# Altium project reflexios_front.PrjPcb
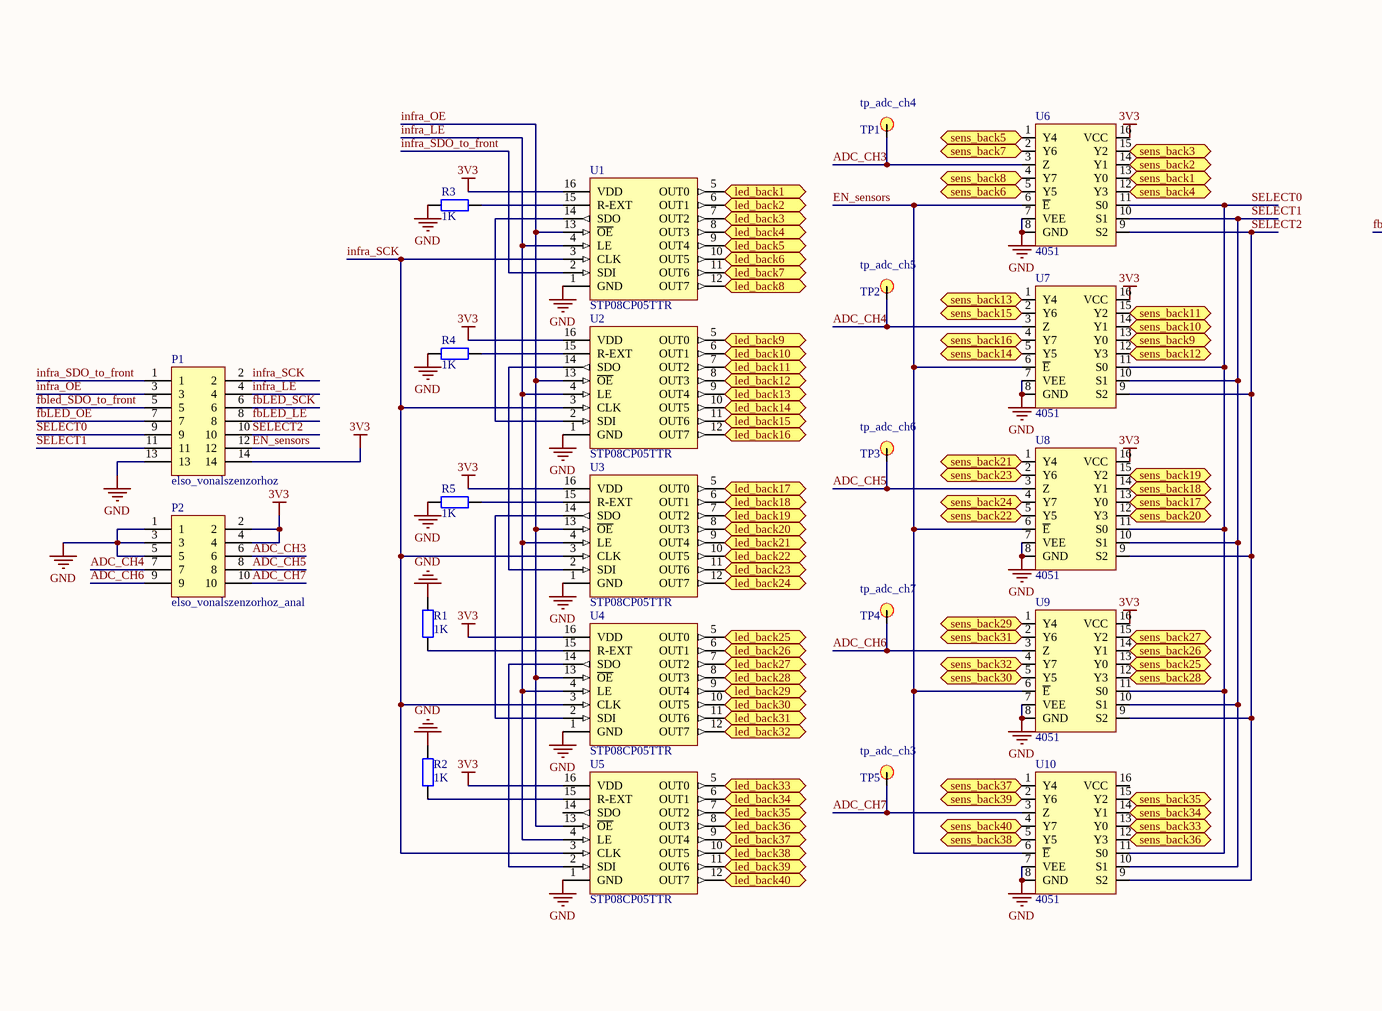
[diagram p0: front.SchDoc, top left]
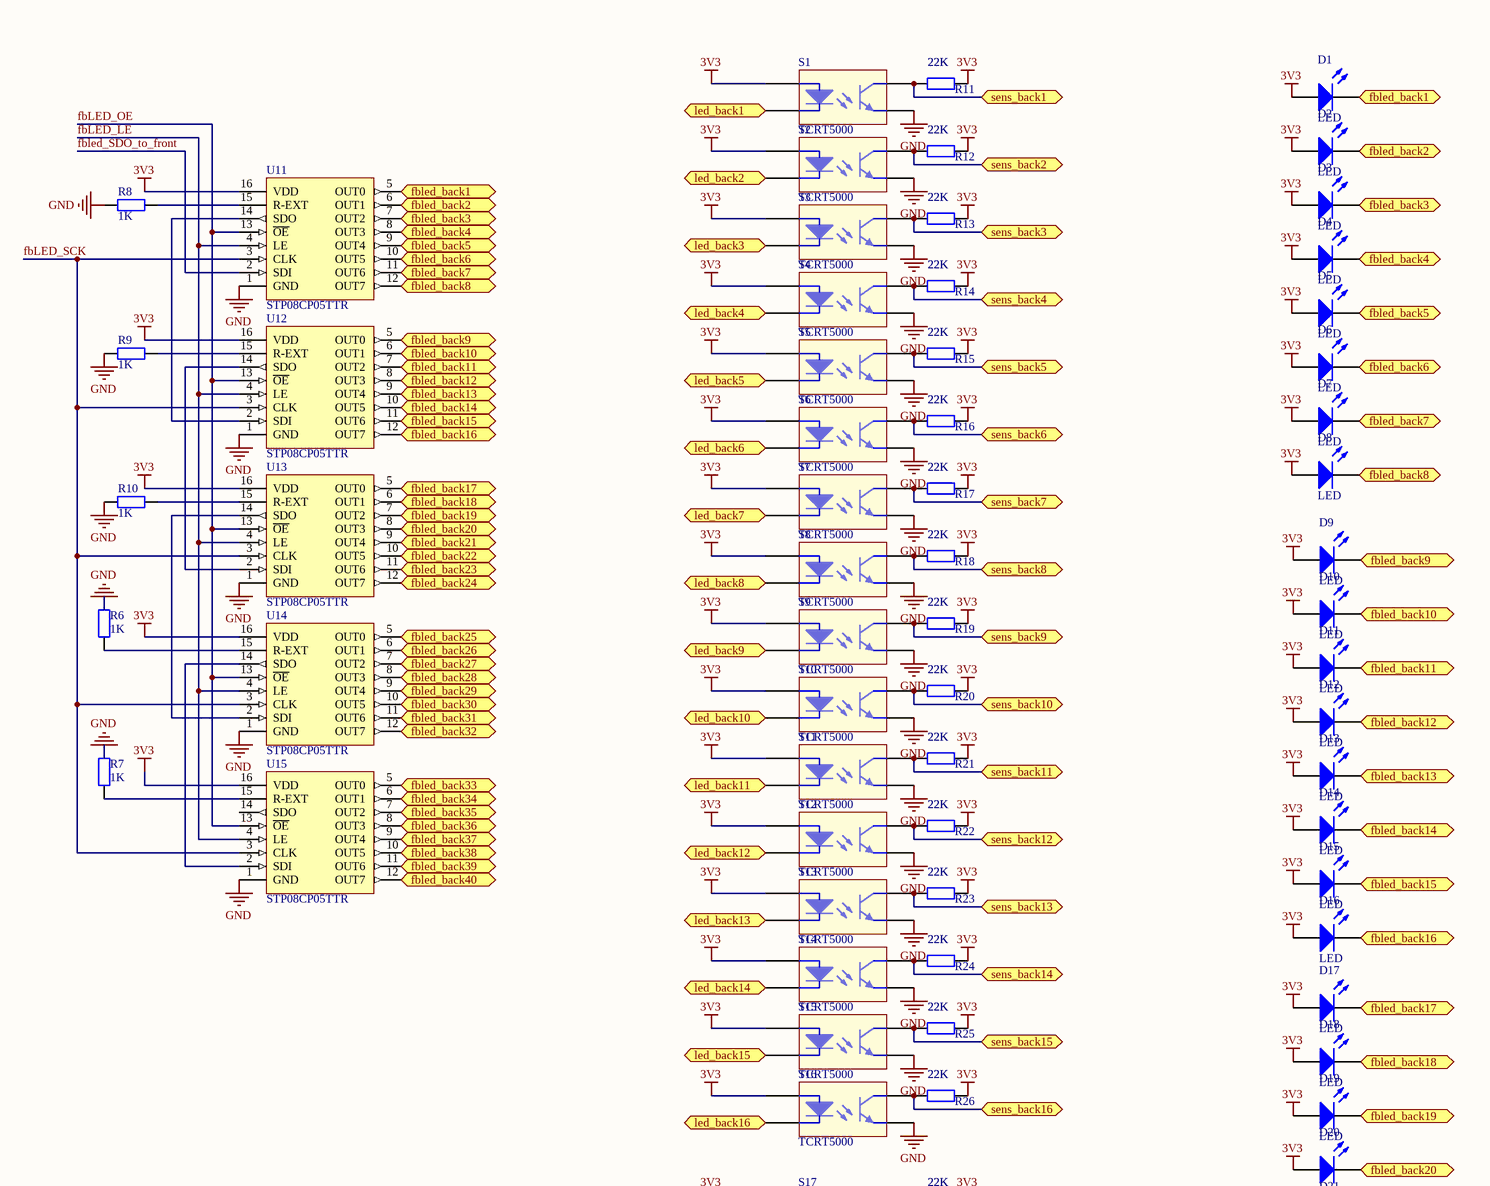
[diagram p1: front.SchDoc, top right]
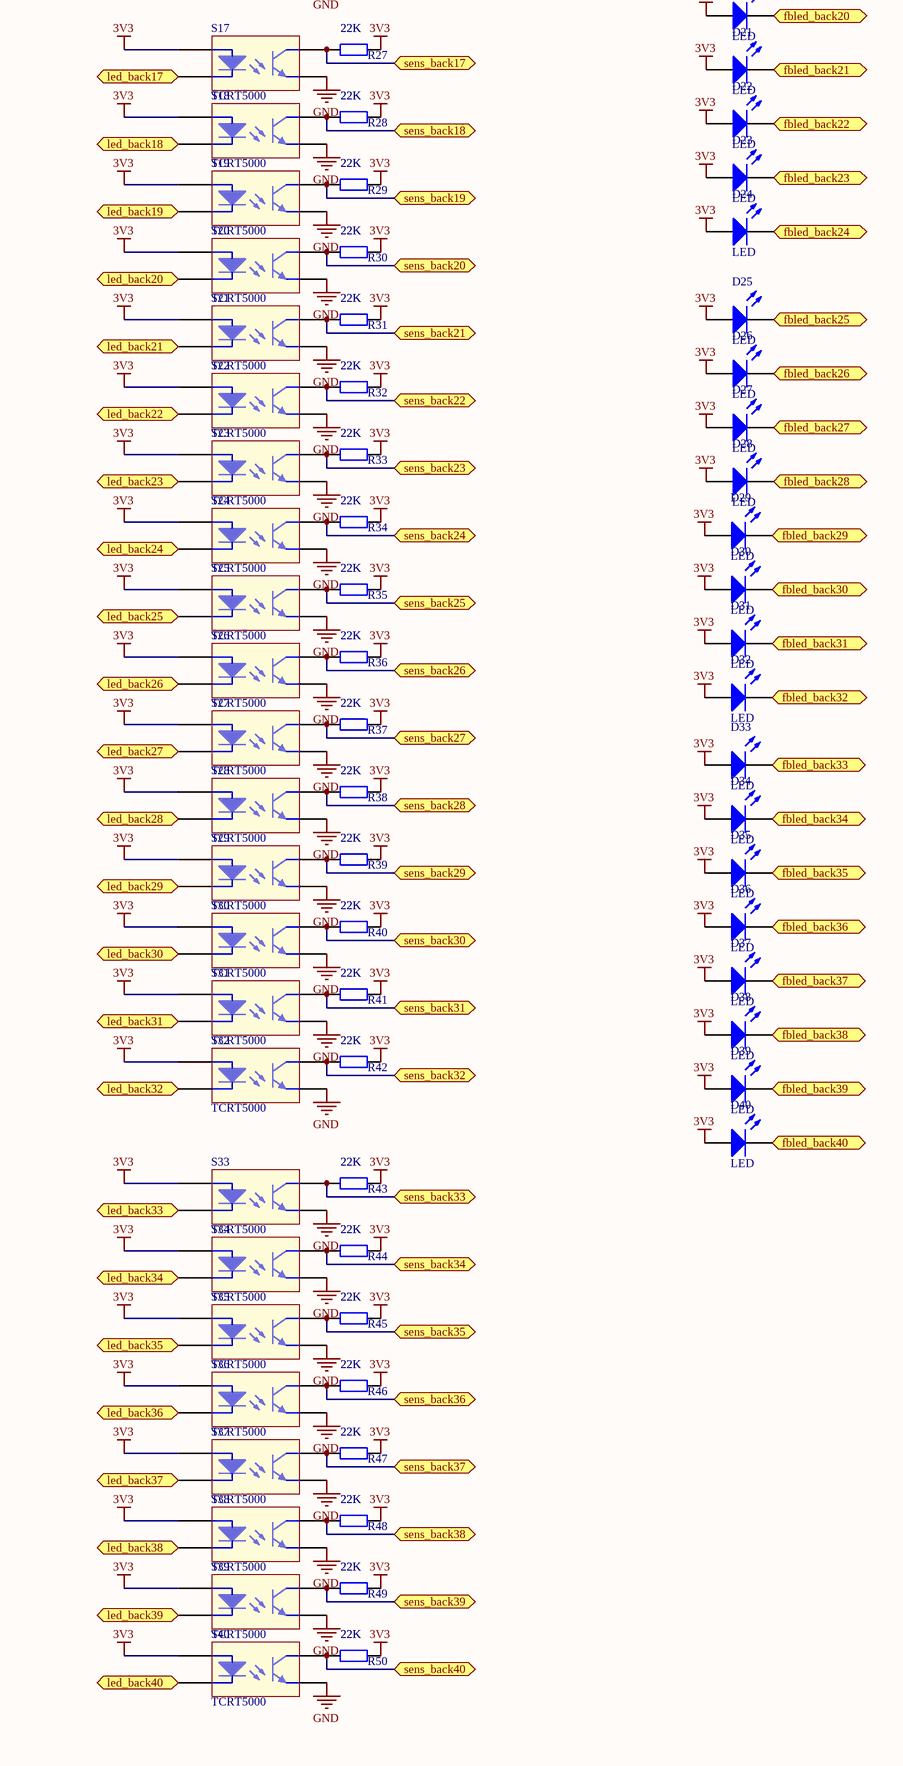
[diagram p2: front.SchDoc, bottom right]
1 sheet, 152 parts. Net scope: flat (ports and power ports of the same name join across sheets).
Board file: 6C-2L-1550um.PcbDoc

## Sheet front.SchDoc
size A0

### Parts
D1  LED  [FP_1210_LED]
D2  LED  [FP_1210_LED]
D3  LED  [FP_1210_LED]
D4  LED  [FP_1210_LED]
D5  LED  [FP_1210_LED]
D6  LED  [FP_1210_LED]
D7  LED  [FP_1210_LED]
D8  LED  [FP_1210_LED]
D9  LED  [FP_1210_LED]
D10  LED  [FP_1210_LED]
D11  LED  [FP_1210_LED]
D12  LED  [FP_1210_LED]
D13  LED  [FP_1210_LED]
D14  LED  [FP_1210_LED]
D15  LED  [FP_1210_LED]
D16  LED  [FP_1210_LED]
D17  LED  [FP_1210_LED]
D18  LED  [FP_1210_LED]
D19  LED  [FP_1210_LED]
D20  LED  [FP_1210_LED]
D21  LED  [FP_1210_LED]
D22  LED  [FP_1210_LED]
D23  LED  [FP_1210_LED]
D24  LED  [FP_1210_LED]
D25  LED  [FP_1210_LED]
D26  LED  [FP_1210_LED]
D27  LED  [FP_1210_LED]
D28  LED  [FP_1210_LED]
D29  LED  [FP_1210_LED]
D30  LED  [FP_1210_LED]
D31  LED  [FP_1210_LED]
D32  LED  [FP_1210_LED]
D33  LED  [FP_1210_LED]
D34  LED  [FP_1210_LED]
D35  LED  [FP_1210_LED]
D36  LED  [FP_1210_LED]
D37  LED  [FP_1210_LED]
D38  LED  [FP_1210_LED]
D39  LED  [FP_1210_LED]
D40  LED  [FP_1210_LED]
P1  elso_vonalszenzorhoz  [FP_CONN14]
P2  elso_vonalszenzorhoz_anal  [FP_CONN10]
R1  1K  [FP_1206_RES]
R2  1K  [FP_1206_RES]
R3  1K  [FP_1206_RES]
R4  1K  [FP_1206_RES]
R5  1K  [FP_1206_RES]
R6  1K  [FP_1206_RES]
R7  1K  [FP_1206_RES]
R8  1K  [FP_1206_RES]
R9  1K  [FP_1206_RES]
R10  1K  [FP_1206_RES]
R11  22K  [FP_1206_RES]
R12  22K  [FP_1206_RES]
R13  22K  [FP_1206_RES]
R14  22K  [FP_1206_RES]
R15  22K  [FP_1206_RES]
R16  22K  [FP_1206_RES]
R17  22K  [FP_1206_RES]
R18  22K  [FP_1206_RES]
R19  22K  [FP_1206_RES]
R20  22K  [FP_1206_RES]
R21  22K  [FP_1206_RES]
R22  22K  [FP_1206_RES]
R23  22K  [FP_1206_RES]
R24  22K  [FP_1206_RES]
R25  22K  [FP_1206_RES]
R26  22K  [FP_1206_RES]
R27  22K  [FP_1206_RES]
R28  22K  [FP_1206_RES]
R29  22K  [FP_1206_RES]
R30  22K  [FP_1206_RES]
R31  22K  [FP_1206_RES]
R32  22K  [FP_1206_RES]
R33  22K  [FP_1206_RES]
R34  22K  [FP_1206_RES]
R35  22K  [FP_1206_RES]
R36  22K  [FP_1206_RES]
R37  22K  [FP_1206_RES]
R38  22K  [FP_1206_RES]
R39  22K  [FP_1206_RES]
R40  22K  [FP_1206_RES]
R41  22K  [FP_1206_RES]
R42  22K  [FP_1206_RES]
R43  22K  [FP_1206_RES]
R44  22K  [FP_1206_RES]
R45  22K  [FP_1206_RES]
R46  22K  [FP_1206_RES]
R47  22K  [FP_1206_RES]
R48  22K  [FP_1206_RES]
R49  22K  [FP_1206_RES]
R50  22K  [FP_1206_RES]
S1  TCRT5000  [TCRT5000]
S2  TCRT5000  [TCRT5000]
S3  TCRT5000  [TCRT5000]
S4  TCRT5000  [TCRT5000]
S5  TCRT5000  [TCRT5000]
S6  TCRT5000  [TCRT5000]
S7  TCRT5000  [TCRT5000]
S8  TCRT5000  [TCRT5000]
S9  TCRT5000  [TCRT5000]
S10  TCRT5000  [TCRT5000]
S11  TCRT5000  [TCRT5000]
S12  TCRT5000  [TCRT5000]
S13  TCRT5000  [TCRT5000]
S14  TCRT5000  [TCRT5000]
S15  TCRT5000  [TCRT5000]
S16  TCRT5000  [TCRT5000]
S17  TCRT5000  [TCRT5000]
S18  TCRT5000  [TCRT5000]
S19  TCRT5000  [TCRT5000]
S20  TCRT5000  [TCRT5000]
S21  TCRT5000  [TCRT5000]
S22  TCRT5000  [TCRT5000]
S23  TCRT5000  [TCRT5000]
S24  TCRT5000  [TCRT5000]
S25  TCRT5000  [TCRT5000]
S26  TCRT5000  [TCRT5000]
S27  TCRT5000  [TCRT5000]
S28  TCRT5000  [TCRT5000]
S29  TCRT5000  [TCRT5000]
S30  TCRT5000  [TCRT5000]
S31  TCRT5000  [TCRT5000]
S32  TCRT5000  [TCRT5000]
S33  TCRT5000  [TCRT5000]
S34  TCRT5000  [TCRT5000]
S35  TCRT5000  [TCRT5000]
S36  TCRT5000  [TCRT5000]
S37  TCRT5000  [TCRT5000]
S38  TCRT5000  [TCRT5000]
S39  TCRT5000  [TCRT5000]
S40  TCRT5000  [TCRT5000]
TP1  tp_adc_ch4
TP2  tp_adc_ch5
TP3  tp_adc_ch6
TP4  tp_adc_ch7
TP5  tp_adc_ch3
U1  STP08CP05TTR  [TSOP65P640X120-16M]
U2  STP08CP05TTR  [TSOP65P640X120-16M]
U3  STP08CP05TTR  [TSOP65P640X120-16M]
U4  STP08CP05TTR  [TSOP65P640X120-16M]
U5  STP08CP05TTR  [TSOP65P640X120-16M]
U6  4051  [SO16_N]
U7  4051  [SO16_N]
U8  4051  [SO16_N]
U9  4051  [SO16_N]
U10  4051  [SO16_N]
U11  STP08CP05TTR  [TSOP65P640X120-16M]
U12  STP08CP05TTR  [TSOP65P640X120-16M]
U13  STP08CP05TTR  [TSOP65P640X120-16M]
U14  STP08CP05TTR  [TSOP65P640X120-16M]
U15  STP08CP05TTR  [TSOP65P640X120-16M]

### Ports
fbled_back1, fbled_back2, fbled_back3, fbled_back4, fbled_back5, fbled_back6, fbled_back7, fbled_back8, fbled_back9, fbled_back10, fbled_back11, fbled_back12, fbled_back13, fbled_back14, fbled_back15, fbled_back16, fbled_back17, fbled_back18, fbled_back19, fbled_back20, fbled_back21, fbled_back22, fbled_back23, fbled_back24, fbled_back25, fbled_back26, fbled_back27, fbled_back28, fbled_back29, fbled_back30, fbled_back31, fbled_back32, fbled_back33, fbled_back34, fbled_back35, fbled_back36, fbled_back37, fbled_back38, fbled_back39, fbled_back40, led_back1, led_back2, led_back3, led_back4, led_back5, led_back6, led_back7, led_back8, led_back9, led_back10, led_back11, led_back12, led_back13, led_back14, led_back15, led_back16, led_back17, led_back18, led_back19, led_back20, led_back21, led_back22, led_back23, led_back24, led_back25, led_back26, led_back27, led_back28, led_back29, led_back30, led_back31, led_back32, led_back33, led_back34, led_back35, led_back36, led_back37, led_back38, led_back39, led_back40, sens_back1, sens_back2, sens_back3, sens_back4, sens_back5, sens_back6, sens_back7, sens_back8, sens_back9, sens_back10, sens_back11, sens_back12, sens_back13, sens_back14, sens_back15, sens_back16, sens_back17, sens_back18, sens_back19, sens_back20, sens_back21, sens_back22, sens_back23, sens_back24, sens_back25, sens_back26, sens_back27, sens_back28, sens_back29, sens_back30, sens_back31, sens_back32, sens_back33, sens_back34, sens_back35, sens_back36, sens_back37, sens_back38, sens_back39, sens_back40

### Nets
3V3: D1.1(A) D2.1(A) D3.1(A) D4.1(A) D5.1(A) D6.1(A) D7.1(A) D8.1(A) D9.1(A) D10.1(A) D11.1(A) D12.1(A) D13.1(A) D14.1(A) D15.1(A) D16.1(A) D17.1(A) D18.1(A) D19.1(A) D20.1(A) D21.1(A) D22.1(A) D23.1(A) D24.1(A) D25.1(A) D26.1(A) D27.1(A) D28.1(A) D29.1(A) D30.1(A) D31.1(A) D32.1(A) D33.1(A) D34.1(A) D35.1(A) D36.1(A) D37.1(A) D38.1(A) D39.1(A) D40.1(A) P1.14 P2.2 P2.4 R11.2 R12.2 R13.2 R14.2 R15.2 R16.2 R17.2 R18.2 R19.2 R20.2 R21.2 R22.2 R23.2 R24.2 R25.2 R26.2 R27.2 R28.2 R29.2 R30.2 R31.2 R32.2 R33.2 R34.2 R35.2 R36.2 R37.2 R38.2 R39.2 R40.2 R41.2 R42.2 R43.2 R44.2 R45.2 R46.2 R47.2 R48.2 R49.2 R50.2 S1.1(A) S2.1(A) S3.1(A) S4.1(A) S5.1(A) S6.1(A) S7.1(A) S8.1(A) S9.1(A) S10.1(A) S11.1(A) S12.1(A) S13.1(A) S14.1(A) S15.1(A) S16.1(A) S17.1(A) S18.1(A) S19.1(A) S20.1(A) S21.1(A) S22.1(A) S23.1(A) S24.1(A) S25.1(A) S26.1(A) S27.1(A) S28.1(A) S29.1(A) S30.1(A) S31.1(A) S32.1(A) S33.1(A) S34.1(A) S35.1(A) S36.1(A) S37.1(A) S38.1(A) S39.1(A) S40.1(A) U1.16(VDD) U2.16(VDD) U3.16(VDD) U4.16(VDD) U5.16(VDD) U6.16(VCC) U7.16(VCC) U8.16(VCC) U9.16(VCC) U11.16(VDD) U12.16(VDD) U13.16(VDD) U14.16(VDD) U15.16(VDD)
GND: P1.13 P2.1 P2.3 P2.5 R1.1 R2.1 R3.1 R4.1 R5.1 R6.1 R7.1 R8.1 R9.1 R10.1 S1.4(E) S2.4(E) S3.4(E) S4.4(E) S5.4(E) S6.4(E) S7.4(E) S8.4(E) S9.4(E) S10.4(E) S11.4(E) S12.4(E) S13.4(E) S14.4(E) S15.4(E) S16.4(E) S17.4(E) S18.4(E) S19.4(E) S20.4(E) S21.4(E) S22.4(E) S23.4(E) S24.4(E) S25.4(E) S26.4(E) S27.4(E) S28.4(E) S29.4(E) S30.4(E) S31.4(E) S32.4(E) S33.4(E) S34.4(E) S35.4(E) S36.4(E) S37.4(E) S38.4(E) S39.4(E) S40.4(E) U1.1(GND) U2.1(GND) U3.1(GND) U4.1(GND) U5.1(GND) U6.7(VEE) U6.8(GND) U7.7(VEE) U7.8(GND) U8.7(VEE) U8.8(GND) U9.7(VEE) U9.8(GND) U10.7(VEE) U10.8(GND) U11.1(GND) U12.1(GND) U13.1(GND) U14.1(GND) U15.1(GND)
ADC_CH3: P2.6 TP1.1 U6.3(Z)
ADC_CH4: P2.7 TP2.1 U7.3(Z)
ADC_CH5: P2.8 TP3.1 U8.3(Z)
ADC_CH6: P2.9 TP4.1 U9.3(Z)
ADC_CH7: P2.10 TP5.1 U10.3(Z)
EN_sensors: P1.12 U6.6(~{E}) U7.6(~{E}) U8.6(~{E}) U9.6(~{E}) U10.6(~{E})
fbLED_LE: P1.8 U11.4(LE) U12.4(LE) U13.4(LE) U14.4(LE) U15.4(LE)
fbLED_OE: P1.7 U11.13(~{OE}) U12.13(~{OE}) U13.13(~{OE}) U14.13(~{OE}) U15.13(~{OE})
fbLED_SCK: P1.6 U11.3(CLK) U12.3(CLK) U13.3(CLK) U14.3(CLK) U15.3(CLK)
fbled_SDO_to_front: P1.5 U11.2(SDI)
infra_LE: P1.4 U1.4(LE) U2.4(LE) U3.4(LE) U4.4(LE) U5.4(LE)
infra_OE: P1.3 U1.13(~{OE}) U2.13(~{OE}) U3.13(~{OE}) U4.13(~{OE}) U5.13(~{OE})
infra_SCK: P1.2 U1.3(CLK) U2.3(CLK) U3.3(CLK) U4.3(CLK) U5.3(CLK)
infra_SDO_to_front: P1.1 U1.2(SDI)
SELECT0: P1.9 U6.11(S0) U7.11(S0) U8.11(S0) U9.11(S0) U10.11(S0)
SELECT1: P1.11 U6.10(S1) U7.10(S1) U8.10(S1) U9.10(S1) U10.10(S1)
SELECT2: P1.10 U6.9(S2) U7.9(S2) U8.9(S2) U9.9(S2) U10.9(S2)
NetD1_2: D1.2(K) U11.5(OUT0) ; port fbled_back1
NetD2_2: D2.2(K) U11.6(OUT1) ; port fbled_back2
NetD3_2: D3.2(K) U11.7(OUT2) ; port fbled_back3
NetD4_2: D4.2(K) U11.8(OUT3) ; port fbled_back4
NetD5_2: D5.2(K) U11.9(OUT4) ; port fbled_back5
NetD6_2: D6.2(K) U11.10(OUT5) ; port fbled_back6
NetD7_2: D7.2(K) U11.11(OUT6) ; port fbled_back7
NetD8_2: D8.2(K) U11.12(OUT7) ; port fbled_back8
NetD9_2: D9.2(K) U12.5(OUT0) ; port fbled_back9
NetD10_2: D10.2(K) U12.6(OUT1) ; port fbled_back10
NetD11_2: D11.2(K) U12.7(OUT2) ; port fbled_back11
NetD12_2: D12.2(K) U12.8(OUT3) ; port fbled_back12
NetD13_2: D13.2(K) U12.9(OUT4) ; port fbled_back13
NetD14_2: D14.2(K) U12.10(OUT5) ; port fbled_back14
NetD15_2: D15.2(K) U12.11(OUT6) ; port fbled_back15
NetD16_2: D16.2(K) U12.12(OUT7) ; port fbled_back16
NetD17_2: D17.2(K) U13.5(OUT0) ; port fbled_back17
NetD18_2: D18.2(K) U13.6(OUT1) ; port fbled_back18
NetD19_2: D19.2(K) U13.7(OUT2) ; port fbled_back19
NetD20_2: D20.2(K) U13.8(OUT3) ; port fbled_back20
NetD21_2: D21.2(K) U13.9(OUT4) ; port fbled_back21
NetD22_2: D22.2(K) U13.10(OUT5) ; port fbled_back22
NetD23_2: D23.2(K) U13.11(OUT6) ; port fbled_back23
NetD24_2: D24.2(K) U13.12(OUT7) ; port fbled_back24
NetD25_2: D25.2(K) U14.5(OUT0) ; port fbled_back25
NetD26_2: D26.2(K) U14.6(OUT1) ; port fbled_back26
NetD27_2: D27.2(K) U14.7(OUT2) ; port fbled_back27
NetD28_2: D28.2(K) U14.8(OUT3) ; port fbled_back28
NetD29_2: D29.2(K) U14.9(OUT4) ; port fbled_back29
NetD30_2: D30.2(K) U14.10(OUT5) ; port fbled_back30
NetD31_2: D31.2(K) U14.11(OUT6) ; port fbled_back31
NetD32_2: D32.2(K) U14.12(OUT7) ; port fbled_back32
NetD33_2: D33.2(K) U15.5(OUT0) ; port fbled_back33
NetD34_2: D34.2(K) U15.6(OUT1) ; port fbled_back34
NetD35_2: D35.2(K) U15.7(OUT2) ; port fbled_back35
NetD36_2: D36.2(K) U15.8(OUT3) ; port fbled_back36
NetD37_2: D37.2(K) U15.9(OUT4) ; port fbled_back37
NetD38_2: D38.2(K) U15.10(OUT5) ; port fbled_back38
NetD39_2: D39.2(K) U15.11(OUT6) ; port fbled_back39
NetD40_2: D40.2(K) U15.12(OUT7) ; port fbled_back40
NetR1_2: R1.2 U4.15(R-EXT)
NetR2_2: R2.2 U5.15(R-EXT)
NetR3_2: R3.2 U1.15(R-EXT)
NetR4_2: R4.2 U2.15(R-EXT)
NetR5_2: R5.2 U3.15(R-EXT)
NetR6_2: R6.2 U14.15(R-EXT)
NetR7_2: R7.2 U15.15(R-EXT)
NetR8_2: R8.2 U11.15(R-EXT)
NetR9_2: R9.2 U12.15(R-EXT)
NetR10_2: R10.2 U13.15(R-EXT)
NetR11_1: R11.1 S1.3(C) U6.13(Y0) ; port sens_back1
NetR12_1: R12.1 S2.3(C) U6.14(Y1) ; port sens_back2
NetR13_1: R13.1 S3.3(C) U6.15(Y2) ; port sens_back3
NetR14_1: R14.1 S4.3(C) U6.12(Y3) ; port sens_back4
NetR15_1: R15.1 S5.3(C) U6.1(Y4) ; port sens_back5
NetR16_1: R16.1 S6.3(C) U6.5(Y5) ; port sens_back6
NetR17_1: R17.1 S7.3(C) U6.2(Y6) ; port sens_back7
NetR18_1: R18.1 S8.3(C) U6.4(Y7) ; port sens_back8
NetR19_1: R19.1 S9.3(C) U7.13(Y0) ; port sens_back9
NetR20_1: R20.1 S10.3(C) U7.14(Y1) ; port sens_back10
NetR21_1: R21.1 S11.3(C) U7.15(Y2) ; port sens_back11
NetR22_1: R22.1 S12.3(C) U7.12(Y3) ; port sens_back12
NetR23_1: R23.1 S13.3(C) U7.1(Y4) ; port sens_back13
NetR24_1: R24.1 S14.3(C) U7.5(Y5) ; port sens_back14
NetR25_1: R25.1 S15.3(C) U7.2(Y6) ; port sens_back15
NetR26_1: R26.1 S16.3(C) U7.4(Y7) ; port sens_back16
NetR27_1: R27.1 S17.3(C) U8.13(Y0) ; port sens_back17
NetR28_1: R28.1 S18.3(C) U8.14(Y1) ; port sens_back18
NetR29_1: R29.1 S19.3(C) U8.15(Y2) ; port sens_back19
NetR30_1: R30.1 S20.3(C) U8.12(Y3) ; port sens_back20
NetR31_1: R31.1 S21.3(C) U8.1(Y4) ; port sens_back21
NetR32_1: R32.1 S22.3(C) U8.5(Y5) ; port sens_back22
NetR33_1: R33.1 S23.3(C) U8.2(Y6) ; port sens_back23
NetR34_1: R34.1 S24.3(C) U8.4(Y7) ; port sens_back24
NetR35_1: R35.1 S25.3(C) U9.13(Y0) ; port sens_back25
NetR36_1: R36.1 S26.3(C) U9.14(Y1) ; port sens_back26
NetR37_1: R37.1 S27.3(C) U9.15(Y2) ; port sens_back27
NetR38_1: R38.1 S28.3(C) U9.12(Y3) ; port sens_back28
NetR39_1: R39.1 S29.3(C) U9.1(Y4) ; port sens_back29
NetR40_1: R40.1 S30.3(C) U9.5(Y5) ; port sens_back30
NetR41_1: R41.1 S31.3(C) U9.2(Y6) ; port sens_back31
NetR42_1: R42.1 S32.3(C) U9.4(Y7) ; port sens_back32
NetR43_1: R43.1 S33.3(C) U10.13(Y0) ; port sens_back33
NetR44_1: R44.1 S34.3(C) U10.14(Y1) ; port sens_back34
NetR45_1: R45.1 S35.3(C) U10.15(Y2) ; port sens_back35
NetR46_1: R46.1 S36.3(C) U10.12(Y3) ; port sens_back36
NetR47_1: R47.1 S37.3(C) U10.1(Y4) ; port sens_back37
NetR48_1: R48.1 S38.3(C) U10.5(Y5) ; port sens_back38
NetR49_1: R49.1 S39.3(C) U10.2(Y6) ; port sens_back39
NetR50_1: R50.1 S40.3(C) U10.4(Y7) ; port sens_back40
NetS1_2: S1.2(K) U1.5(OUT0) ; port led_back1
NetS2_2: S2.2(K) U1.6(OUT1) ; port led_back2
NetS3_2: S3.2(K) U1.7(OUT2) ; port led_back3
NetS4_2: S4.2(K) U1.8(OUT3) ; port led_back4
NetS5_2: S5.2(K) U1.9(OUT4) ; port led_back5
NetS6_2: S6.2(K) U1.10(OUT5) ; port led_back6
NetS7_2: S7.2(K) U1.11(OUT6) ; port led_back7
NetS8_2: S8.2(K) U1.12(OUT7) ; port led_back8
NetS9_2: S9.2(K) U2.5(OUT0) ; port led_back9
NetS10_2: S10.2(K) U2.6(OUT1) ; port led_back10
NetS11_2: S11.2(K) U2.7(OUT2) ; port led_back11
NetS12_2: S12.2(K) U2.8(OUT3) ; port led_back12
NetS13_2: S13.2(K) U2.9(OUT4) ; port led_back13
NetS14_2: S14.2(K) U2.10(OUT5) ; port led_back14
NetS15_2: S15.2(K) U2.11(OUT6) ; port led_back15
NetS16_2: S16.2(K) U2.12(OUT7) ; port led_back16
NetS17_2: S17.2(K) U3.5(OUT0) ; port led_back17
NetS18_2: S18.2(K) U3.6(OUT1) ; port led_back18
NetS19_2: S19.2(K) U3.7(OUT2) ; port led_back19
NetS20_2: S20.2(K) U3.8(OUT3) ; port led_back20
NetS21_2: S21.2(K) U3.9(OUT4) ; port led_back21
NetS22_2: S22.2(K) U3.10(OUT5) ; port led_back22
NetS23_2: S23.2(K) U3.11(OUT6) ; port led_back23
NetS24_2: S24.2(K) U3.12(OUT7) ; port led_back24
NetS25_2: S25.2(K) U4.5(OUT0) ; port led_back25
NetS26_2: S26.2(K) U4.6(OUT1) ; port led_back26
NetS27_2: S27.2(K) U4.7(OUT2) ; port led_back27
NetS28_2: S28.2(K) U4.8(OUT3) ; port led_back28
NetS29_2: S29.2(K) U4.9(OUT4) ; port led_back29
NetS30_2: S30.2(K) U4.10(OUT5) ; port led_back30
NetS31_2: S31.2(K) U4.11(OUT6) ; port led_back31
NetS32_2: S32.2(K) U4.12(OUT7) ; port led_back32
NetS33_2: S33.2(K) U5.5(OUT0) ; port led_back33
NetS34_2: S34.2(K) U5.6(OUT1) ; port led_back34
NetS35_2: S35.2(K) U5.7(OUT2) ; port led_back35
NetS36_2: S36.2(K) U5.8(OUT3) ; port led_back36
NetS37_2: S37.2(K) U5.9(OUT4) ; port led_back37
NetS38_2: S38.2(K) U5.10(OUT5) ; port led_back38
NetS39_2: S39.2(K) U5.11(OUT6) ; port led_back39
NetS40_2: S40.2(K) U5.12(OUT7) ; port led_back40
NetU1_14: U1.14(SDO) U2.2(SDI)
NetU2_14: U2.14(SDO) U3.2(SDI)
NetU3_14: U3.14(SDO) U4.2(SDI)
NetU4_14: U4.14(SDO) U5.2(SDI)
NetU11_14: U11.14(SDO) U12.2(SDI)
NetU12_14: U12.14(SDO) U13.2(SDI)
NetU13_14: U13.14(SDO) U14.2(SDI)
NetU14_14: U14.14(SDO) U15.2(SDI)

Not connected (* = marked no-connect by the designer): U5 14(SDO); U10 16(VCC); U15 14(SDO)

### Library data of the parts
D1-D40 = LED: Typical RED GaAs LED; pin to pad: 1>A 2>K; Supplier: sajat rendelesbol lesznek
P1 = Connector_14pin: 14pin Connector
P2 = Connector_10pin: 10pin Connector
R1-R10 = RES: Resistor; Value: 1K
R11-R50 = Res2: Resistor; Name: 22K0 1206 1% WR12X2202FTL 0.25W (WAL); Value: 22K; Supplier: Lomex; Reference: 80-42-61
S1-S40 = TCRT5000: Reflective Optical Sensor; Reference: 1470066; Name: TCRT5000 -  Reflective Photo Interrupter, Phototransistor, Through Hole, 15 mm, 60 mA, 5 Vr, 1.25 Vf; Supplier: Farnell
TP1-TP5 = TestPoint: 1pin testpoint
U1-U5 U11-U15 = STP08CP05TTR: Low voltage, low current power 8-bit shift register
U6-U10 = 74HC4051: 8:1 analog mux; Name: 74HC4051D (NXP) 8-INPUT ANALOG MULTIPLEXER/DEMULTIPLEXER SO-16 MUX/DEMUX; Reference: 87-05-61; Supplier: Lomex